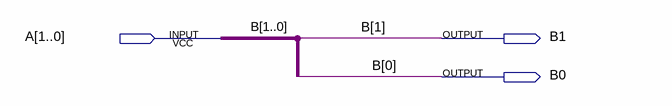
[diagram p0: schematic sheet]
// Quartus schematic debus2.bdf as structural Verilog: 0 symbols, 3 pins
module debus2 (
  input  [1:0] A,
  output B1,
  output B0
);


  assign B0 = A[0];
  assign B1 = A[1];

  // Other names for the same wires on the sheet: B[1:0] = A
endmodule
